# Altium schematic sheet Battery charger.SchDoc
size 297 x 209 mm; DocumentNumber: 1; SheetNumber: 1; SheetTotal: 1
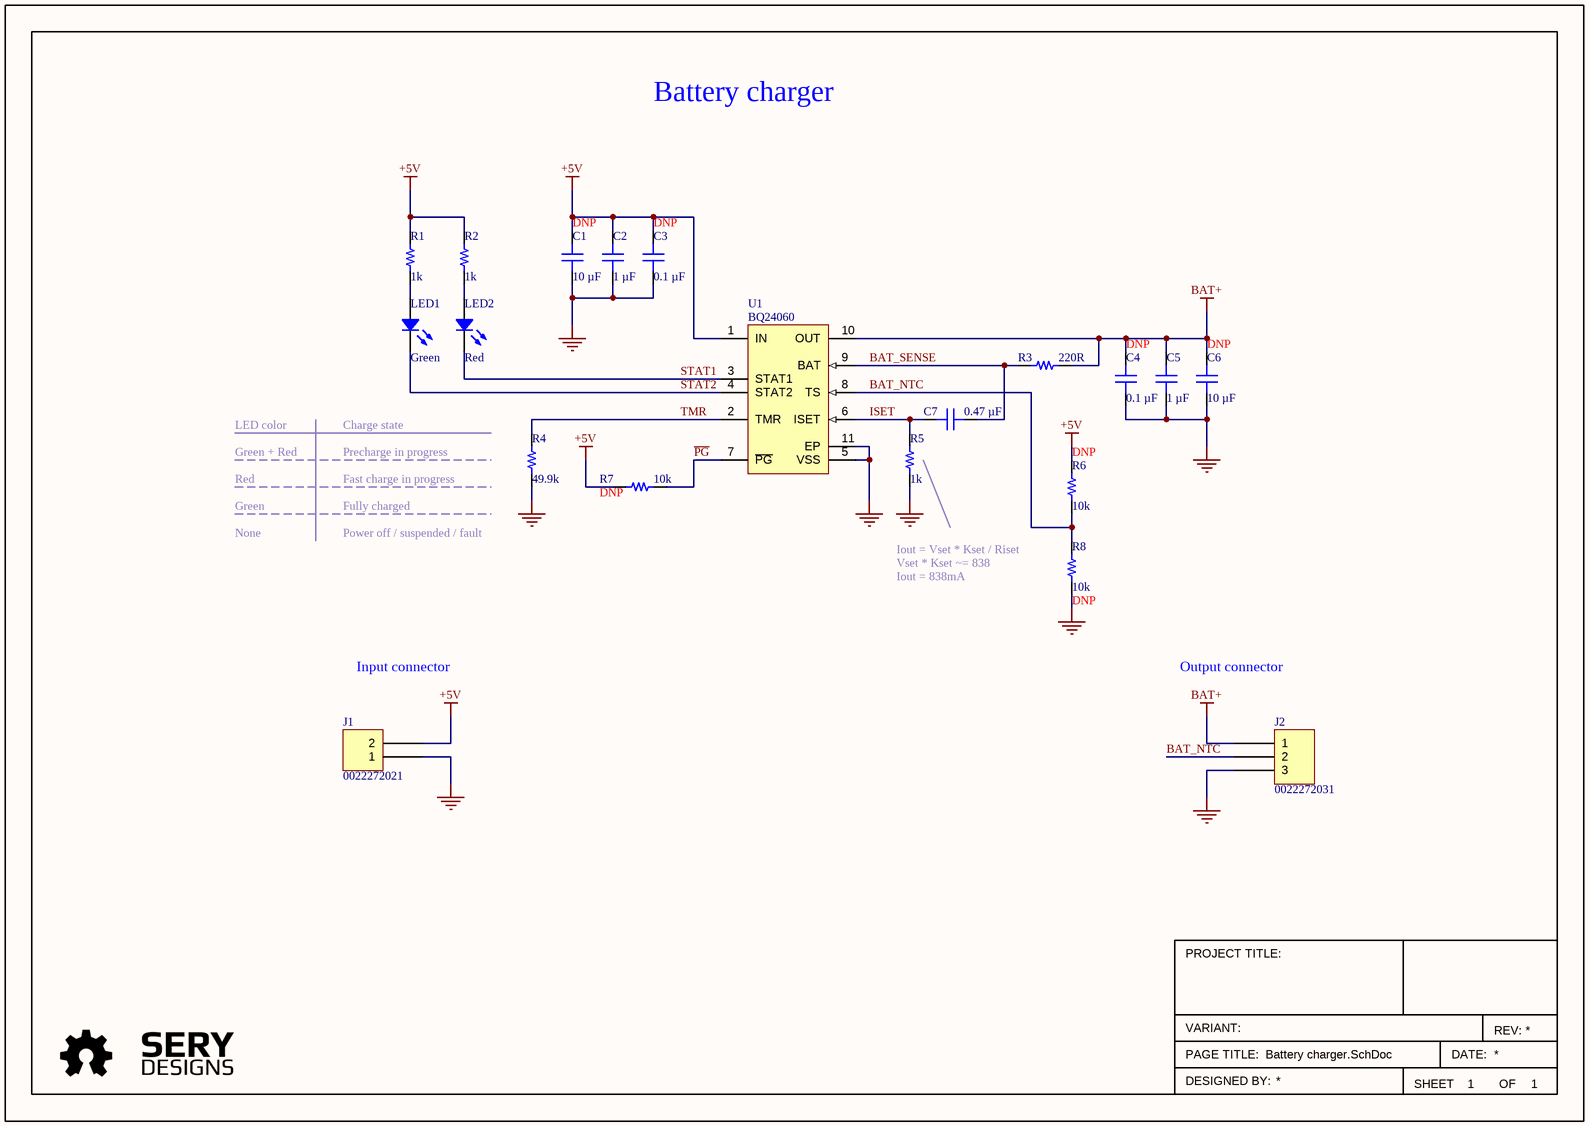
[diagram p0: Battery charger.SchDoc]

## Parts
C1  10 µF  [CAP 0805_2012]
C2  1 µF  [CAP 0603_1608]
C3  0.1 µF  [CAP 0402_1005]
C4  0.1 µF  [CAP 0402_1005]
C5  1 µF  [CAP 0603_1608]
C6  10 µF  [CAP 0805_2012]
C7  0.47 µF  [CAP 0402_1005]
J1  0022272021  [MOLEX KK 0022272021]
J2  0022272031  [MOLEX KK 0022272031]
LED1  Green  [LED 0603_1608 GREEN]
LED2  Red  [LED 0603_1608 RED]
OSHW-logo1  OSHW-logo  [OSHW-logo]  (value not drawn)  (no BOM)
R1  1k  [RES 0402_1005]
R2  1k  [RES 0402_1005]
R3  220R  [RES 0402_1005]
R4  49.9k  [RES 0402_1005]
R5  1k  [RES 0402_1005]
R6  10k  [RES 0402_1005]
R7  10k  [RES 0402_1005]
R8  10k  [RES 0402_1005]
SeryDesigns-logo1  SeryDesigns-logo  [SeryDesigns-logo]  (value not drawn)  (no BOM)
U1  BQ24060  [BQ24060-VSON]

## Nets
+5V: C1.2 C2.2 C3.2 J1.2 R1.2 R2.2 R6.1 R7.2 U1.1(IN)
BAT+: C4.2 C5.2 C6.2 J2.1 R3.2 U1.10(OUT)
GND: C1.1 C2.1 C3.1 C4.1 C5.1 C6.1 J1.1 J2.3 R4.1 R5.1 R8.2 U1.5(VSS) U1.11(EP)
BAT_NTC: J2.2 R6.2 R8.1 U1.8(TS)
BAT_SENSE: C7.2 R3.1 U1.9(BAT)
ISET: C7.1 R5.2 U1.6(ISET)
~{PG}: R7.1 U1.7(~{PG})
STAT1: LED2.2 U1.3(STAT1)
STAT2: LED1.2 U1.4(STAT2)
TMR: R4.2 U1.2(TMR)
NetLED1_1: LED1.1 R1.1
NetLED2_1: LED2.1 R2.1

## Notes on the sheet
- Battery charger
- (near C1) DNP
- (near C3) DNP
- (near C4) DNP
- (near C6) DNP
- LED color
- Green + Red
- Charge state
- Precharge in progress
- (near R6) DNP
- Red
- Green
- None
- (near R4) Fast charge in progress
- Fully charged
- Power off / suspended / fault
- (near R7) DNP
- (near R8) Iout = Vset * Kset / Riset
  Vset * Kset ~= 838
  Iout = 838mA
- (near R8) DNP
- Input connector
- Output connector
- PROJECT TITLE:
- VARIANT:
- PAGE TITLE:
- SHEET
- DATE:
- REV:
- OF
- DESIGNED BY:

## Library data of the parts
C1 C6 = GRM21BR61H106ME43L: CAP CER 10UF 50V X5R 0805; manufacturer: Murata Electronics; Tolerance: ±20%; Part Number: GRM21BR61H106ME43L; Value: 10 µF; Applications: General Purpose; Capacitance: 10 µF; componentlink1description: Datasheet; componentlink1url: https://search.murata.co.jp/Ceramy/image/img/A01X/G101/ENG/GRM21BR61H106ME43-01A.pdf; componentlink2description: DigiKey Link; componentlink2url: https://www.digikey.com/en/products/detail/murata-electronics/GRM21BR61H106ME43L/10326317; Device Package: 0805 (2012 Metric); lastupdated: 9/19/2022 1:04:12 PM; Lifecycle Status: Active; Minimum Order: 1; Mounting Type: Surface Mount, MLCC; Operating Temperature: -55°C ~ 85°C; Package / Case: 0805 (2012 Metric); packaging: TapeAndReel; partid: 41295; Part Status: Active; price: 0.08; series: GRM; Size / Dimension: 0.079" L x 0.049" W (2.00mm x 1.25mm); Supplier 1: DigiKey; Supplier Part Number 1: 490-18664-1-ND; Temperature Coefficient: X5R; Thickness (Max): 0.057" (1.45mm); Voltage - Rated: 50V
C2 C5 = UMK107AB7105KA-T: CAP CER 1UF 50V X7R 0603; manufacturer: Taiyo Yuden; Tolerance: ±10%; Part Number: UMK107AB7105KA-T; Value: 1 µF; Applications: SMPS Filtering; Capacitance: 1 µF; componentlink1description: Datasheet; componentlink1url: https://www.yuden.co.jp/productdata/catalog/mlcc01_e.pdf; componentlink2description: DigiKey Link; componentlink2url: https://www.digikey.com/en/products/detail/taiyo-yuden/UMK107AB7105KA-T/3660085; Device Package: 0603 (1608 Metric); lastupdated: 9/19/2022 1:00:51 PM; Lifecycle Status: Active; Minimum Order: 1; Mounting Type: Surface Mount, MLCC; Operating Temperature: -55°C ~ 125°C; Package / Case: 0603 (1608 Metric); packaging: TapeAndReel; partid: 46688; Part Status: Active; price: 0.04; series: M; Size / Dimension: 0.063" L x 0.031" W (1.60mm x 0.80mm); Supplier 1: DigiKey; Supplier Part Number 1: 587-3247-1-ND; Temperature Coefficient: X7R; Thickness (Max): 0.037" (0.95mm); Voltage - Rated: 50V
C3 C4 = CGA2B3X7R1H104M050BB: CAP CER 0.1UF 50V X7R 0402; manufacturer: TDK Corporation; Tolerance: ±20%; Part Number: CGA2B3X7R1H104M050BB; Value: 0.1 µF; Applications: Automotive; Capacitance: 0.1 µF; componentlink1description: Datasheet; componentlink1url: https://product.tdk.com/info/en/catalog/datasheets/mlcc_automotive_general_en.pdf?ref_disty=digikey; componentlink2description: DigiKey Link; componentlink2url: https://www.digikey.com/en/products/detail/tdk-corporation/CGA2B3X7R1H104M050BB/3949507; Device Package: 0402 (1005 Metric); lastupdated: 9/19/2022 12:57:29 PM; Lifecycle Status: Active; Minimum Order: 1; Mounting Type: Surface Mount, MLCC; Operating Temperature: -55°C ~ 125°C; Package / Case: 0402 (1005 Metric); packaging: TapeAndReel; partid: 45577; Part Status: Active; price: 0.01; Ratings: AEC-Q200; series: CGA; Size / Dimension: 0.039" L x 0.020" W (1.00mm x 0.50mm); Supplier 1: DigiKey; Supplier Part Number 1: 445-12271-1-ND; Temperature Coefficient: X7R; Thickness (Max): 0.022" (0.55mm); Voltage - Rated: 50V
C7 = GRM155R61H474KE11D: CAP CER 0.47UF 50V X5R 0402; manufacturer: Murata Electronics; Tolerance: ±10%; Part Number: GRM155R61H474KE11D; Value: 0.47 µF; Applications: General Purpose; Capacitance: 0.47 µF; componentlink1description: Datasheet; componentlink1url: https://search.murata.co.jp/Ceramy/image/img/A01X/G101/ENG/GRM155R61H474KE11-01.pdf; componentlink2description: DigiKey Link; componentlink2url: https://www.digikey.com/en/products/detail/murata-electronics/GRM155R61H474KE11D/7363098; Device Package: 0402 (1005 Metric); lastupdated: 9/19/2022 12:57:29 PM; Lifecycle Status: Active; Minimum Order: 1; Mounting Type: Surface Mount, MLCC; Operating Temperature: -55°C ~ 85°C; Package / Case: 0402 (1005 Metric); packaging: TapeAndReel; partid: 3640; Part Status: Active; price: 0.02; series: GRM; Size / Dimension: 0.039" L x 0.020" W (1.00mm x 0.50mm); Supplier 1: DigiKey; Supplier Part Number 1: 490-16354-1-ND; Temperature Coefficient: X5R; Thickness (Max): 0.022" (0.55mm); Voltage - Rated: 50V
J1 = 0022272021: CONN HEADER VERT 2POS 2.54MM; Manufacturer: Molex; Contact Length - Mating: 0.295" (7.49mm); Contact Length - Post: 0.140" (3.56mm); Material Flammability Rating: UL94 V-0; Number of Positions: 2; Number of Positions Loaded: All; Overall Contact Length: 0.560" (14.22mm); Pitch - Mating: 0.100" (2.54mm); Shrouding: Shrouded - 1 Wall; Style: Board to Cable/Wire; Part Number: 0022272021; ComponentLink1Description: Datasheet; ComponentLink1URL: https://www.molex.com/pdm_docs/sd/022272021_sd.pdf; ComponentLink2Description: DigiKey Link; ComponentLink2URL: http://digikey.com/product-detail/en/molex/0022272021/WM4111-ND/1130577; Connector Type: Header; Contact Finish - Mating: Tin; Contact Finish - Post: Tin; Contact Finish Thickness - Mating: 100.0µin (2.54µm); Contact Material: Brass; Contact Shape: Square; Contact Type: Male Pin; Fastening Type: Friction Lock; Insulation Color: Natural; Insulation Height: 0.461" (11.70mm); Insulation Material: Polyamide (PA), Nylon; LastUpdated: 1/12/2020 11:51:43 PM; Lifecycle Status: Active; Minimum Order: 1; Mounting Type: Through Hole; Number of Rows: 1; Packaging: Bulk; PartId: 76; Part Status: Active; Price: 0.27; Series: KK 6410; Supplier 1: DigiKey; Supplier Part Number 1: WM4111-ND; Termination: Solder
J2 = 0022272031: CONN HEADER VERT 3POS 2.54MM; Manufacturer: Molex; Contact Length - Mating: 0.295" (7.49mm); Contact Length - Post: 0.140" (3.56mm); Material Flammability Rating: UL94 V-0; Number of Positions: 3; Number of Positions Loaded: All; Overall Contact Length: 0.560" (14.22mm); Pitch - Mating: 0.100" (2.54mm); Shrouding: Shrouded - 1 Wall; Style: Board to Cable/Wire; Part Number: 0022272031; ComponentLink1Description: Datasheet; ComponentLink1URL: https://www.molex.com/pdm_docs/sd/022272031_sd.pdf; ComponentLink2Description: DigiKey Link; ComponentLink2URL: http://digikey.com/product-detail/en/molex/0022272031/WM4112-ND/1130578; Connector Type: Header; Contact Finish - Mating: Tin; Contact Finish - Post: Tin; Contact Finish Thickness - Mating: 100.0µin (2.54µm); Contact Material: Brass; Contact Shape: Square; Contact Type: Male Pin; Fastening Type: Friction Lock; Insulation Color: Natural; Insulation Height: 0.461" (11.70mm); Insulation Material: Polyamide (PA), Nylon; LastUpdated: 1/12/2020 11:51:54 PM; Lifecycle Status: Active; Minimum Order: 1; Mounting Type: Through Hole; Number of Rows: 1; Packaging: Bulk; PartId: 77; Part Status: Active; Price: 0.37; Series: KK 6410; Supplier 1: DigiKey; Supplier Part Number 1: WM4112-ND; Termination: Solder
LED1 = 5973316507F: LED GREEN 0603 SMD; Manufacturer: Dialight; Configuration: Standard; Current - Test: 20mA; Lens Color: 1.24mm; Lens Style: Round with Domed Top; Millicandela Rating: 34mcd; Voltage - Forward (Vf) (Typ): 2V; Wavelength - Dominant: 560nm; Part Number: 5973316507F; Color: Green; ComponentLink1Description: Datasheet; ComponentLink1URL: http://www.dialightsignalsandcomponents.com/Assets/Drawings/2D_Drawings_DrawingDetailedSpec/NewDrawings/C18371C.pdf; ComponentLink2Description: DigiKey Link; ComponentLink2URL: https://www.digikey.com/en/products/detail/dialight/5973316507F/9385428; Device Package: 0603 (1608 Metric); Height (Max): 1.24mm; LastUpdated: 9/19/2022 1:49:59 PM; Lifecycle Status: Active; Minimum Order: 1; Mounting Type: Surface Mount; Package / Case: 0603 (1608 Metric); Packaging: TapeAndReel; PartId: 587; Part Status: Active; Price: 0.12; Series: 597; Size / Dimension: 1.60mm L x 0.80mm W; Supplier 1: DigiKey; Supplier Part Number 1: 350-4373-1-ND; Supplier Device Package: 0603; Value: Green
LED2 = 19-213/R6C-AP1Q2B/3T: LED RED CLEAR 2SMD; Manufacturer: Everlight Electronics Co Ltd; Configuration: Standard; Current - Test: 20mA; Lens Color: Colorless; Lens Size: 1.20mm x 0.80mm; Lens Style: Rectangle with Flat Top; Viewing Angle: 120°; Voltage - Forward (Vf) (Typ): 2.05V; Wavelength - Peak: 632nm; Part Number: 19-213/R6C-AP1Q2B/3T; Color: Red; ComponentLink2Description: DigiKey Link; ComponentLink2URL: https://www.digikey.com/en/products/detail/everlight-electronics-co-ltd/19-213-R6C-AP1Q2B-3T/8535271; Device Package: 0603 (1608 Metric); Height (Max): 0.70mm; LastUpdated: 9/19/2022 1:50:25 PM; Lens Transparency: Clear; Lifecycle Status: Active; Minimum Order: 0; Mounting Type: Surface Mount; Package / Case: 0603 (1608 Metric); PartId: 420; Part Status: Active; Price: 0; Series: -; Size / Dimension: 1.60mm L x 0.80mm W; Supplier 1: DigiKey; Supplier Part Number 1: 1080-1577-2-ND; Supplier Device Package: 2-SMD; Value: Red
OSHW-logo1 = OSHW-logo: OSHW logo, no writing
R1 R2 R5 = SFR01MZPF1001: RES SMD 1K OHM 1% 1/16W 0402; Manufacturer: Rohm Semiconductor; Power (Watts): 0.063W, 1/16W; Resistance: 1 kOhms; Temperature Coefficient: ±100ppm/°C; Part Number: SFR01MZPF1001; Value: 1k; ComponentLink1Description: Datasheet; ComponentLink1URL: https://fscdn.rohm.com/en/products/databook/datasheet/passive/resistor/chip_resistor/sfr-e.pdf; ComponentLink2Description: DigiKey Link; ComponentLink2URL: https://www.digikey.com/en/products/detail/rohm-semiconductor/SFR01MZPF1001/15815170; Composition: Thick Film; Device Package: 0402 (1005 Metric); Features: Anti-Sulfur, Automotive AEC-Q200; Height - Seated (Max): 0.016" (0.40mm); LastUpdated: 9/19/2022 1:13:48 PM; Lifecycle Status: Active; Minimum Order: 1; Number of Terminations: 2; Operating Temperature: -55°C ~ 155°C; Package / Case: 0402 (1005 Metric); Packaging: TapeAndReel; PartId: 59471; Part Status: Active; Price: 0.01; Ratings: AEC-Q200; Series: SFR; Size / Dimension: 0.039" L x 0.020" W (1.00mm x 0.50mm); Supplier 1: DigiKey; Supplier Part Number 1: 511-SFR01MZPF1001CT-ND; Supplier Device Package: 0402; Tolerance: ±1%
R3 = RT0402FRE07220RL: RES SMD 220 OHM 1% 1/16W 0402; Manufacturer: Yageo; Power (Watts): 0.063W, 1/16W; Resistance: 220 Ohms; Temperature Coefficient: ±50ppm/°C; Part Number: RT0402FRE07220RL; Value: 220R; ComponentLink1Description: Datasheet; ComponentLink1URL: https://www.yageo.com/upload/media/product/productsearch/datasheet/rchip/PYu-RT_1-to-0.01_RoHS_L_12.pdf; ComponentLink2Description: DigiKey Link; ComponentLink2URL: https://www.digikey.com/en/products/detail/yageo/RT0402FRE07220RL/1071875; Composition: Thin Film; Device Package: 0402 (1005 Metric); Height - Seated (Max): 0.014" (0.35mm); LastUpdated: 9/19/2022 1:13:42 PM; Lifecycle Status: Active; Minimum Order: 1; Number of Terminations: 2; Operating Temperature: -55°C ~ 155°C; Package / Case: 0402 (1005 Metric); Packaging: TapeAndReel; PartId: 64852; Part Status: Active; Price: 0.01; Series: RT; Size / Dimension: 0.039" L x 0.020" W (1.00mm x 0.50mm); Supplier 1: DigiKey; Supplier Part Number 1: 13-RT0402FRE07220RLCT-ND; Supplier Device Package: 0402; Tolerance: ±1%
R4 = RT0402FRE0749K9L: RES SMD 49.9K OHM 1% 1/16W 0402; Manufacturer: Yageo; Power (Watts): 0.063W, 1/16W; Resistance: 49.9 kOhms; Temperature Coefficient: ±50ppm/°C; Part Number: RT0402FRE0749K9L; Value: 49.9k; ComponentLink1Description: Datasheet; ComponentLink1URL: https://www.yageo.com/upload/media/product/productsearch/datasheet/rchip/PYu-RT_1-to-0.01_RoHS_L_12.pdf; ComponentLink2Description: DigiKey Link; ComponentLink2URL: https://www.digikey.com/en/products/detail/yageo/RT0402FRE0749K9L/1072041; Composition: Thin Film; Device Package: 0402 (1005 Metric); Height - Seated (Max): 0.014" (0.35mm); LastUpdated: 9/19/2022 1:13:39 PM; Lifecycle Status: Active; Minimum Order: 1; Number of Terminations: 2; Operating Temperature: -55°C ~ 155°C; Package / Case: 0402 (1005 Metric); Packaging: TapeAndReel; PartId: 67324; Part Status: Active; Price: 0.01; Series: RT; Size / Dimension: 0.039" L x 0.020" W (1.00mm x 0.50mm); Supplier 1: DigiKey; Supplier Part Number 1: 13-RT0402FRE0749K9LCT-ND; Supplier Device Package: 0402; Tolerance: ±1%
R6-R8 = AC0402FR-0710KL: RES SMD 10K OHM 1% 1/16W 0402; Manufacturer: Yageo; Power (Watts): 0.063W, 1/16W; Resistance: 10 kOhms; Temperature Coefficient: ±100ppm/°C; Part Number: AC0402FR-0710KL; Value: 10k; ComponentLink1Description: Datasheet; ComponentLink1URL: https://www.yageo.com/upload/media/product/productsearch/datasheet/rchip/PYu-AC_51_RoHS_L_7.pdf; ComponentLink2Description: DigiKey Link; ComponentLink2URL: https://www.digikey.com/en/products/detail/yageo/AC0402FR-0710KL/5895030; Composition: Thick Film; Device Package: 0402 (1005 Metric); Features: Automotive AEC-Q200, Moisture Resistant; Height - Seated (Max): 0.015" (0.37mm); LastUpdated: 9/19/2022 1:14:31 PM; Lifecycle Status: Active; Minimum Order: 1; Number of Terminations: 2; Operating Temperature: -55°C ~ 155°C; Package / Case: 0402 (1005 Metric); Packaging: CutTape; PartId: 12029; Part Status: Active; Price: 0.01; Ratings: AEC-Q200; Series: AC; Size / Dimension: 0.039" L x 0.020" W (1.00mm x 0.50mm); Supplier 1: DigiKey; Supplier Part Number 1: YAG3436CT-ND; Supplier Device Package: 0402; Tolerance: ±1%
SeryDesigns-logo1 = SeryDesigns-logo: Sery designs logo
U1 = BQ24060: IC, SMD, Battery Charger, Li-ion 1-Cell, 10VSON; MPN: BQ24060DRCT; Part Number: 710HV0BQ24060; MF: Texas Instruments; Temp Range: -40°C ~ 85°C (TA); Value: BQ24060; ComponentLink1Description: Datasheet; ComponentLink1URL: https://www.ti.com/lit/ds/symlink/bq24060.pdf?HQS=dis-dk-null-digikeymode-dsf-pf-null-wwe&ts=1655903; Supplier 1: Digi-Key; Supplier Part Number 1: 296-19867-2-ND; Family: ICs; Package: VDFN-10; Mount Type: SMT